# Altium schematic sheet COMM LEVEL SHIFTER.SchDoc: Communication & Level Shifter
size A4; Date: *******; ApprovedBy: *******; Author: *******; CompanyName: *******; Engineer: *******; Organization: *******; Address1: *******; Address2: *******; Address3: *******; Address4: *******; DocumentNumber: 3; Revision: *******; SheetNumber: 3; SheetTotal: 4; CurrentTime: *******; CurrentDate: *******; Time: *******; DocumentFullPathAndName: *******; DocumentName: *******; ModifiedDate: *******; ImagePath: *******; ProjectName: *******; Application_BuildNumber: *******
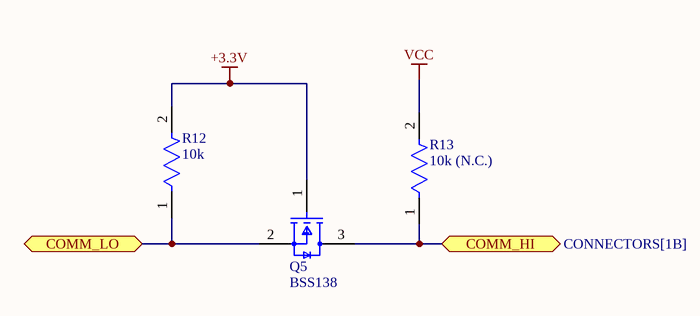
[diagram p0: COMM LEVEL SHIFTER.SchDoc]

## Parts
Q5  BSS138  [FP-318-08-IPC_B]
R12  10k  [FP-RP731J-MFG]
R13  10k (N.C.)  [FP-RP731J-MFG]

## Ports
COMM_HI (bidir, see CONNECTORS[1B]), COMM_LO (bidir, see MCU[2B])

## Nets
+3.3V: Q5.1(G) R12.2
VCC: R13.2
COMM_HI: Q5.3(D) R13.1 ; port COMM_HI
COMM_LO: Q5.2(S) R12.1 ; port COMM_LO

## Notes on the sheet
- Title:
- Drawn By:
- Page Contents:
- Checked By:
- Size:
- Date:
- File:
- License:
- Email:
- A4
- Number:
- Time:
- Revision:
- Sheet
- Website:
- of

## Library data of the parts
Q5 = CMP-07173-000101-1: MOSFET N-CH 50V 220MA SOT-23; Turn-Off Delay Time: 20ns; Element Configuration: Single; Rds On Max: 3.5R; Gate to Source Voltage (Vgs): 20V; Threshold Voltage: 1.3V; Number of Elements: 1; Power Dissipation: 360mW; Rise Time: 9ns; Turn-On Delay Time: 2.5ns; Input Capacitance: 27pF; On-State Resistance: 6R; Lead Free: Lead Free; Length: 2.92mm; Width: 1.3mm; Drain to Source Breakdown Voltage: 50V; Min Operating Temperature: -55°C; REACH SVHC: No SVHC; Packaging: Tape and Reel; Radiation Hardening: No; Height: 0.93mm; Drain to Source Voltage (Vdss): 50V; Current Rating: 220mA; Voltage Rating (DC): 50V; Weight: 0.03g; Continuous Drain Current (ID): 220mA; Number of Pins: 3; Nominal Vgs: 1.3V; Max Power Dissipation: 360mW; Fall Time: 9ns; Drain to Source Resistance: 3.5R; Contact Plating: Tin; Case/Package: SOT-23; Package Quantity: 1; Dual Supply Voltage: 50V; Mount: Surface Mount; Termination: SMD/SMT; Max Operating Temperature: 150°C; LCSC Part #: C5224260
R12 R13 = CMP-03211-008596-1: TE CONNECTIVITY / HOLSWORTHY SMD Chip Resistor, Thin Film, 8.45Ω, 50 V, 0603 [1608 Metric], 100 mW, 0.1% , RP73 Series; Manufacturer Part Number: RP73D1J8R45BTDG; Temperature Coefficient: 15ppm/°C; Resistance: 10kΩ; Voltage Rating: 75V; Value: 10kΩ; Power Rating: 0.1W; Temperature: -55°C to +105°C; octopart_url: https://octopart.com/rp73d1j8r45btdg-te+connectivity-42630912; packaging: cut tape; Manufacturer: TE Connectivity; Device Class L2: Resistors; Series: RP73; Temperature Range High: +105°C; Package: 603; ComponentLink2Description: Datasheet; Octopart: https://octopart.com/rp73d1j8r45btdg-te+connectivity-42630912; Height: 0.55mm; Ipc Land Pattern Name: RESC15580X45; ComponentLink2URL: https://www.te.com/commerce/DocumentDelivery/DDEController?Action=srchrtrv&DocNm=1773272&DocType=DS&DocLang=English; Device Class L3: Chip SMD Resistors; Category: Res; Temperature Range Low: -55°C; RoHS: TRUE; Device Class L1: Passive Components; Tolerance: 0.1%; Composition: Thin Film; Automotive: No; Lead Free: Yes; Case/Package: 603; LCSC Part #: *